# Altium schematic sheet 0176_S Rail power gener.SchDoc
size 848 x 558 mm
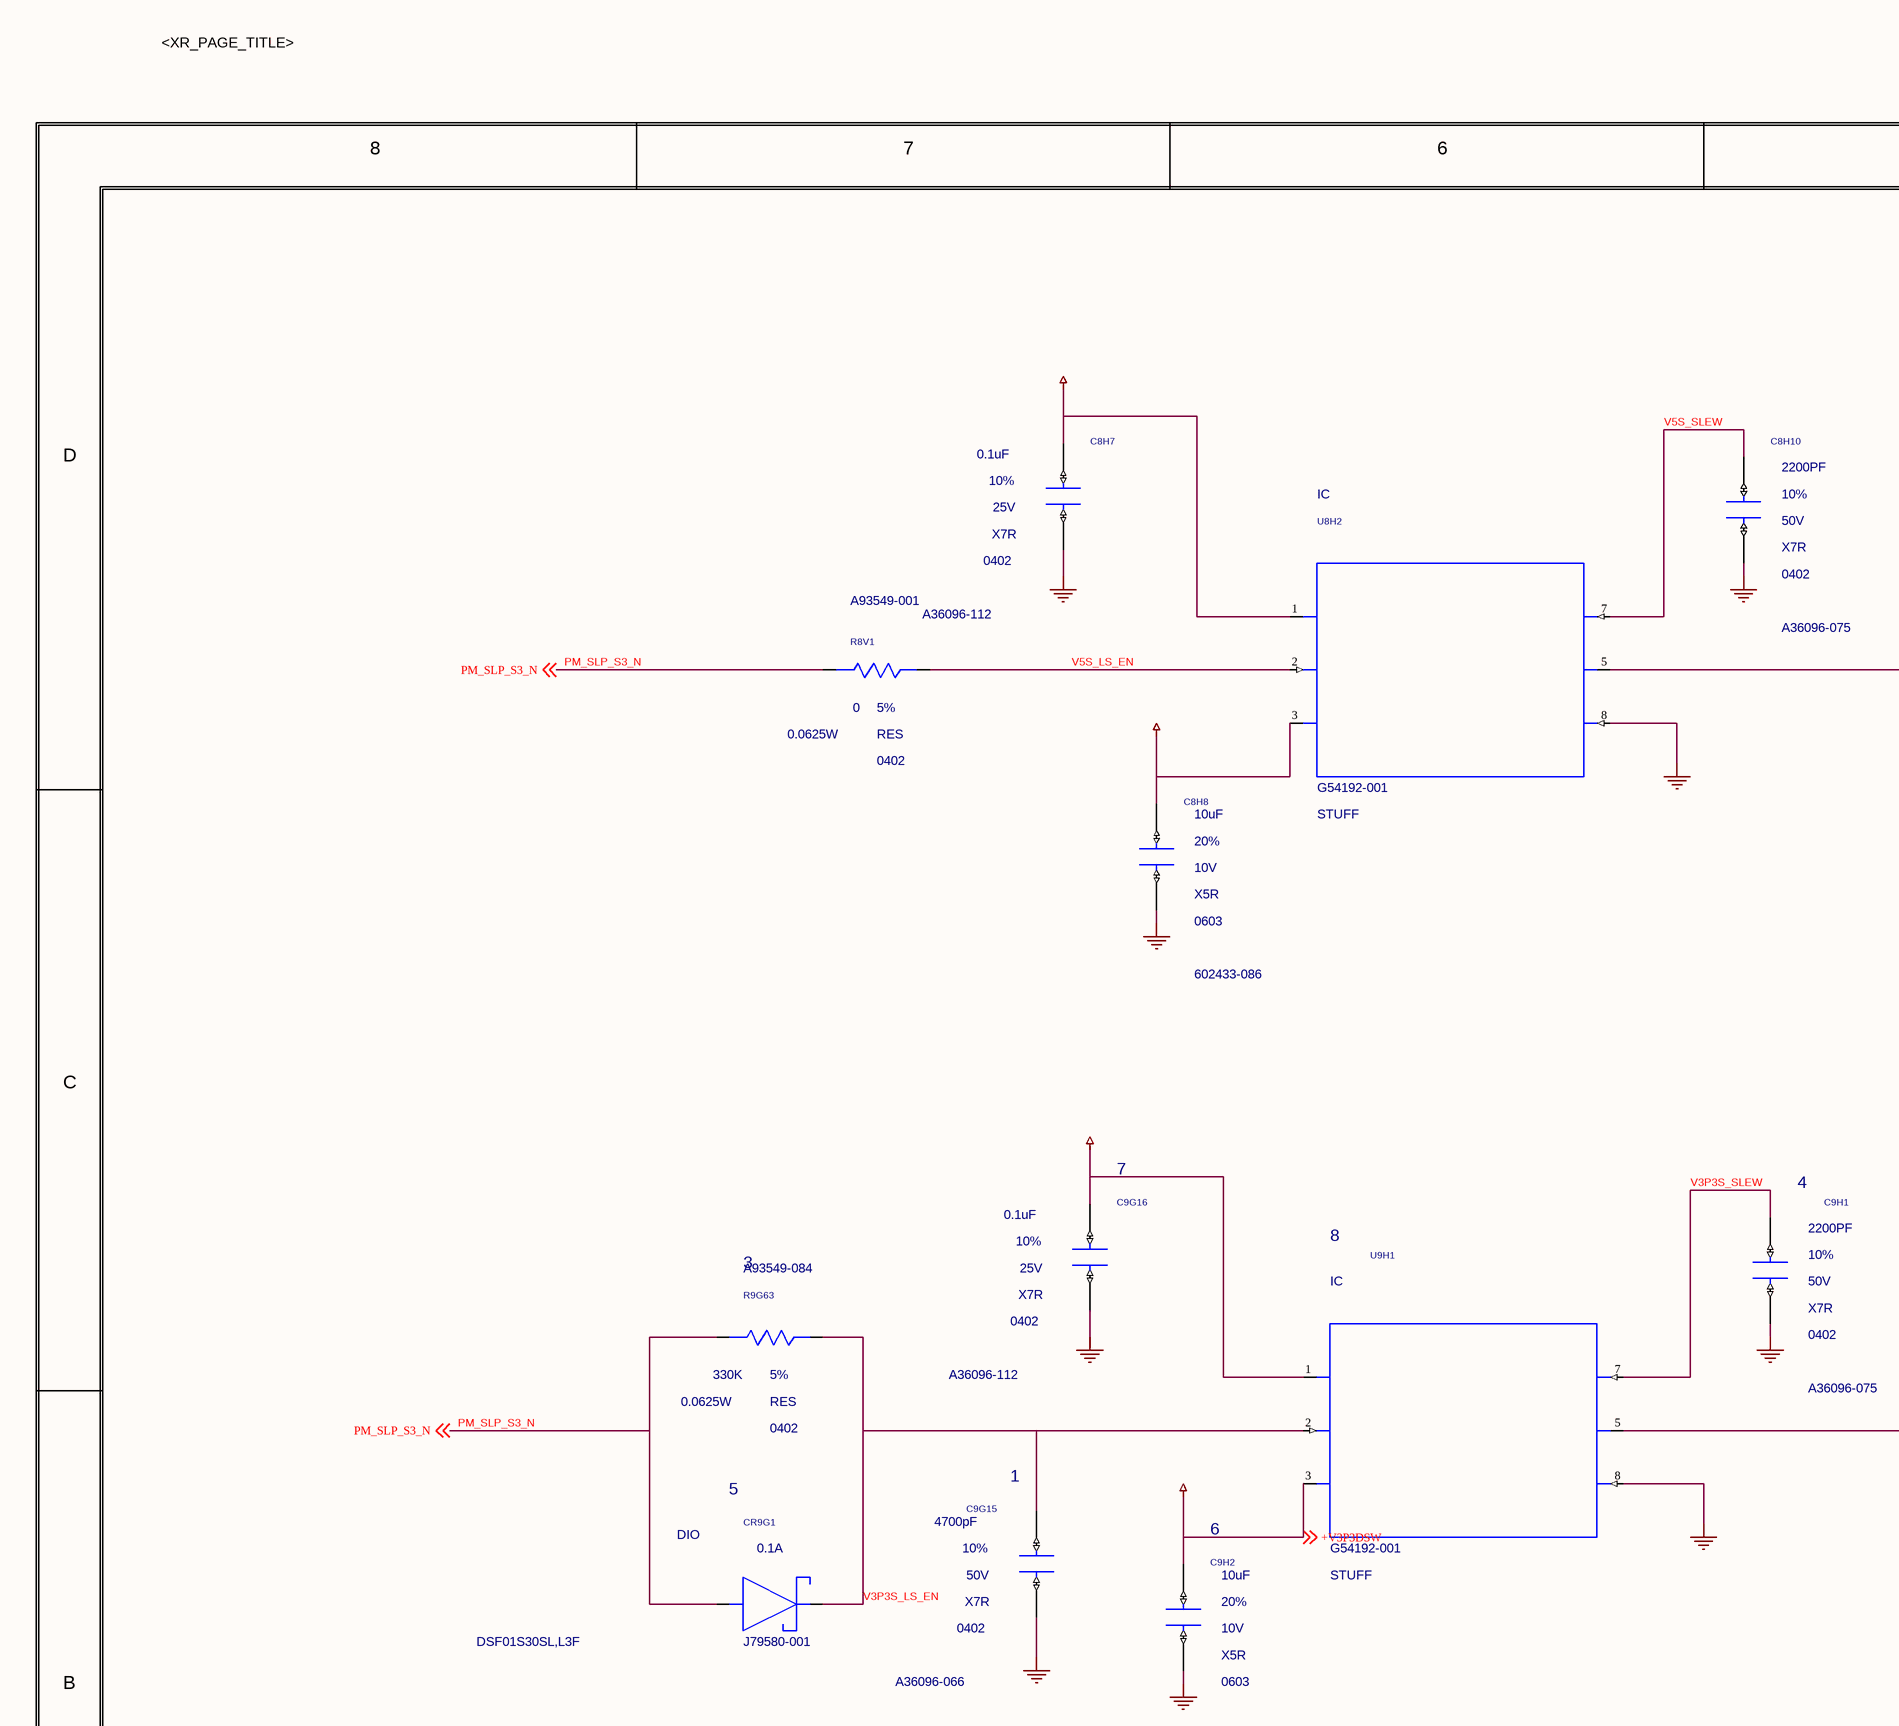
[diagram p0: 0176_S Rail power gener.SchDoc, top left]
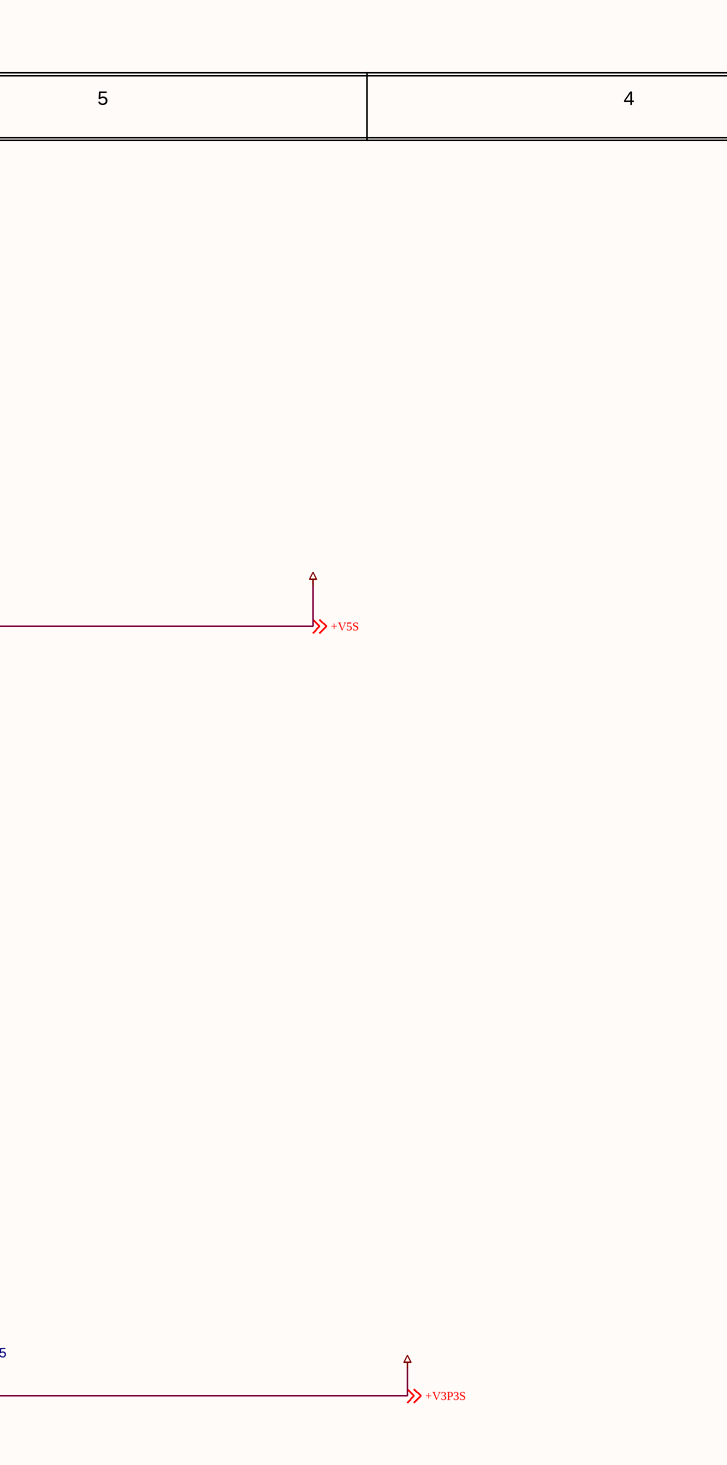
[diagram p1: 0176_S Rail power gener.SchDoc, top middle]
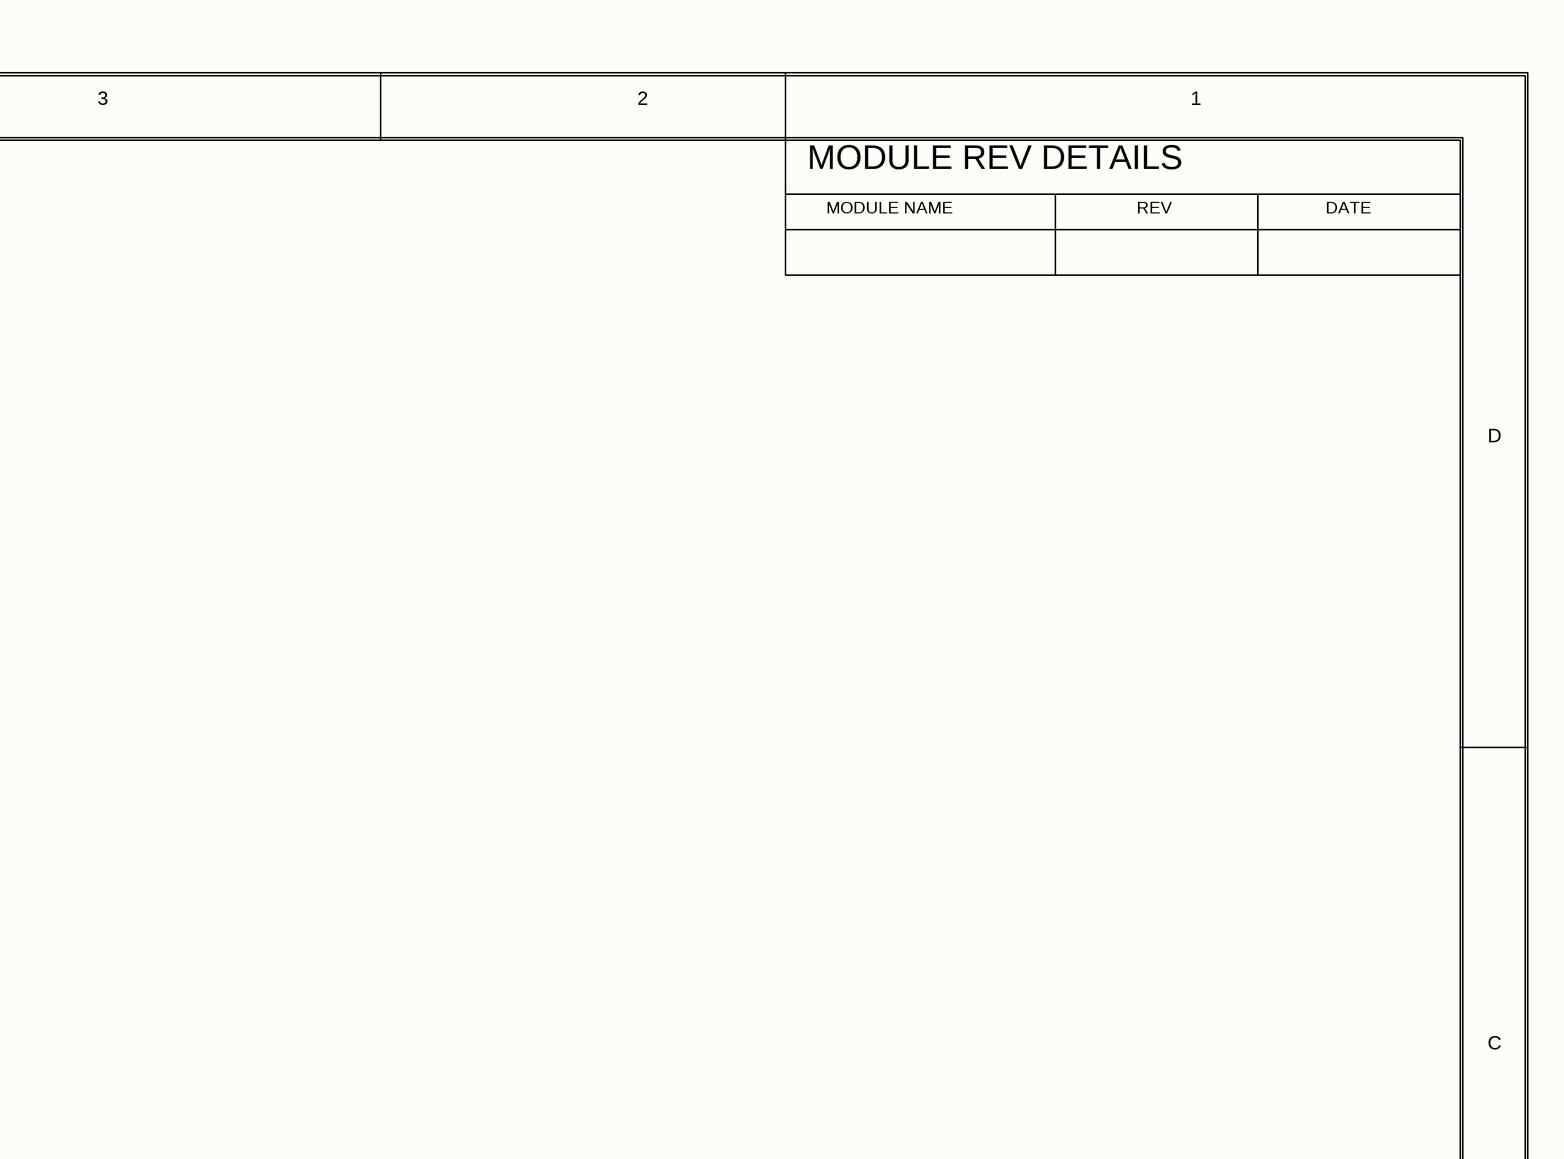
[diagram p2: 0176_S Rail power gener.SchDoc, top right]
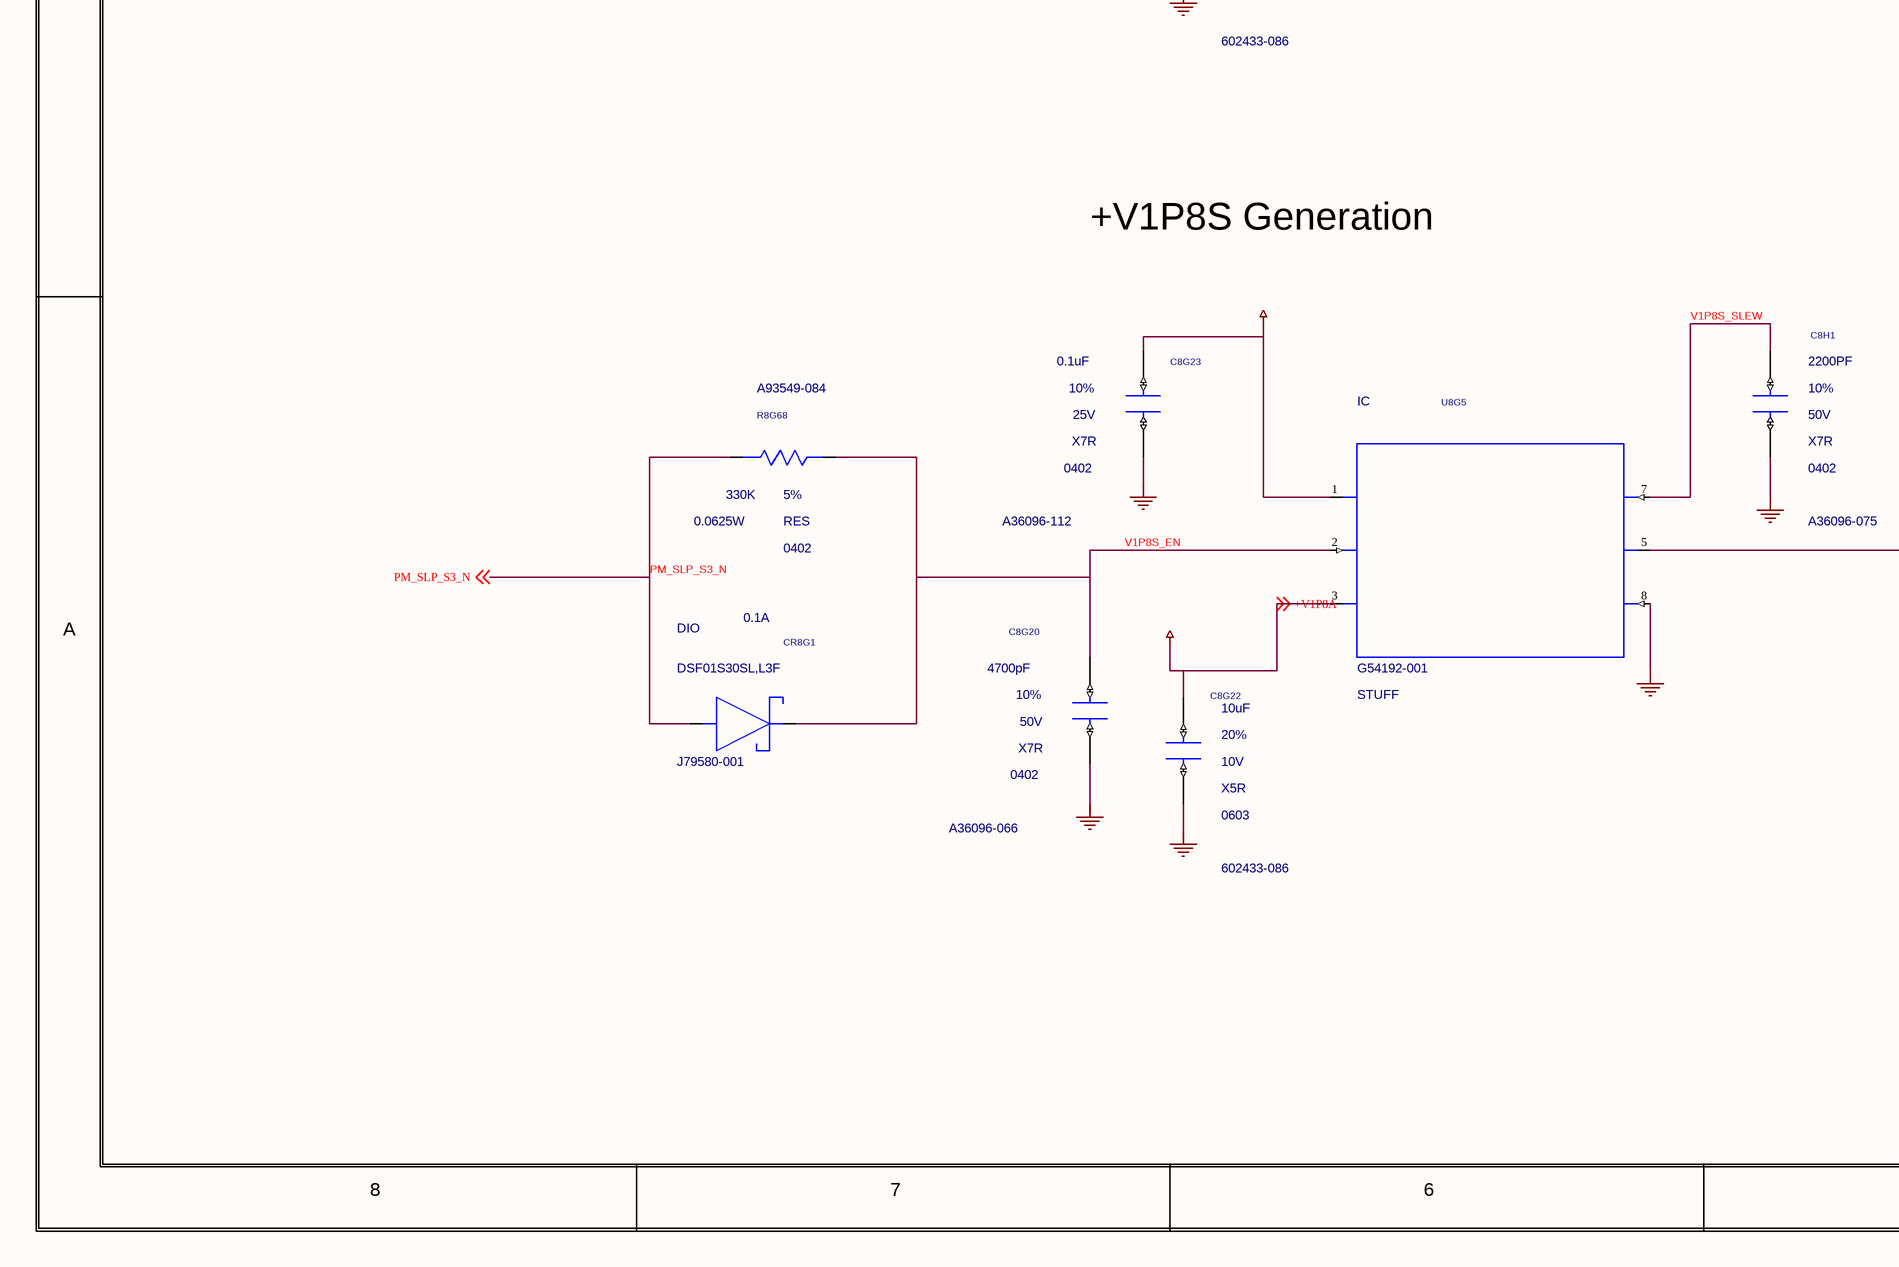
[diagram p3: 0176_S Rail power gener.SchDoc, bottom left]
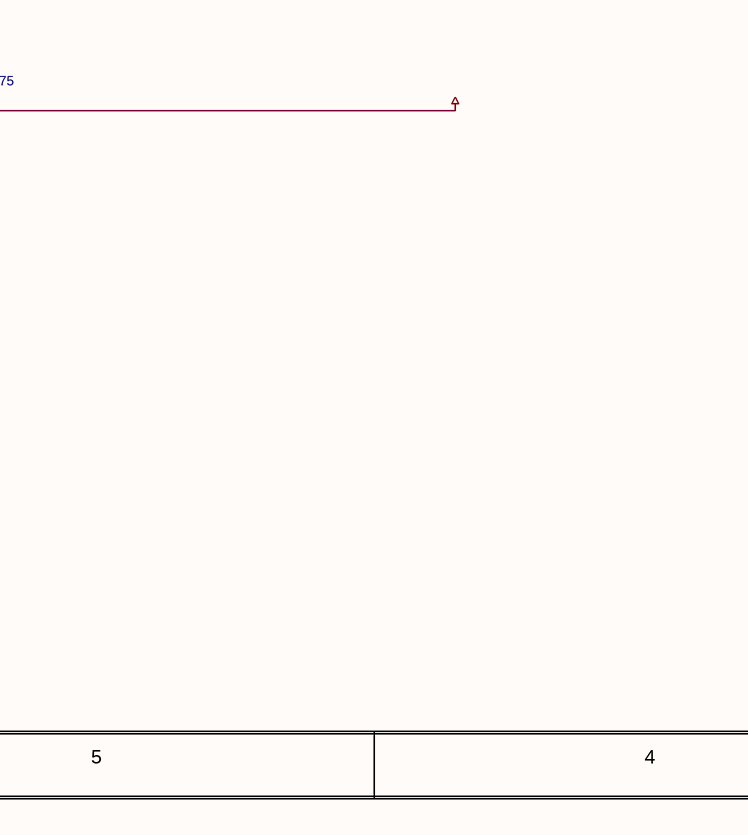
[diagram p4: 0176_S Rail power gener.SchDoc, bottom middle]
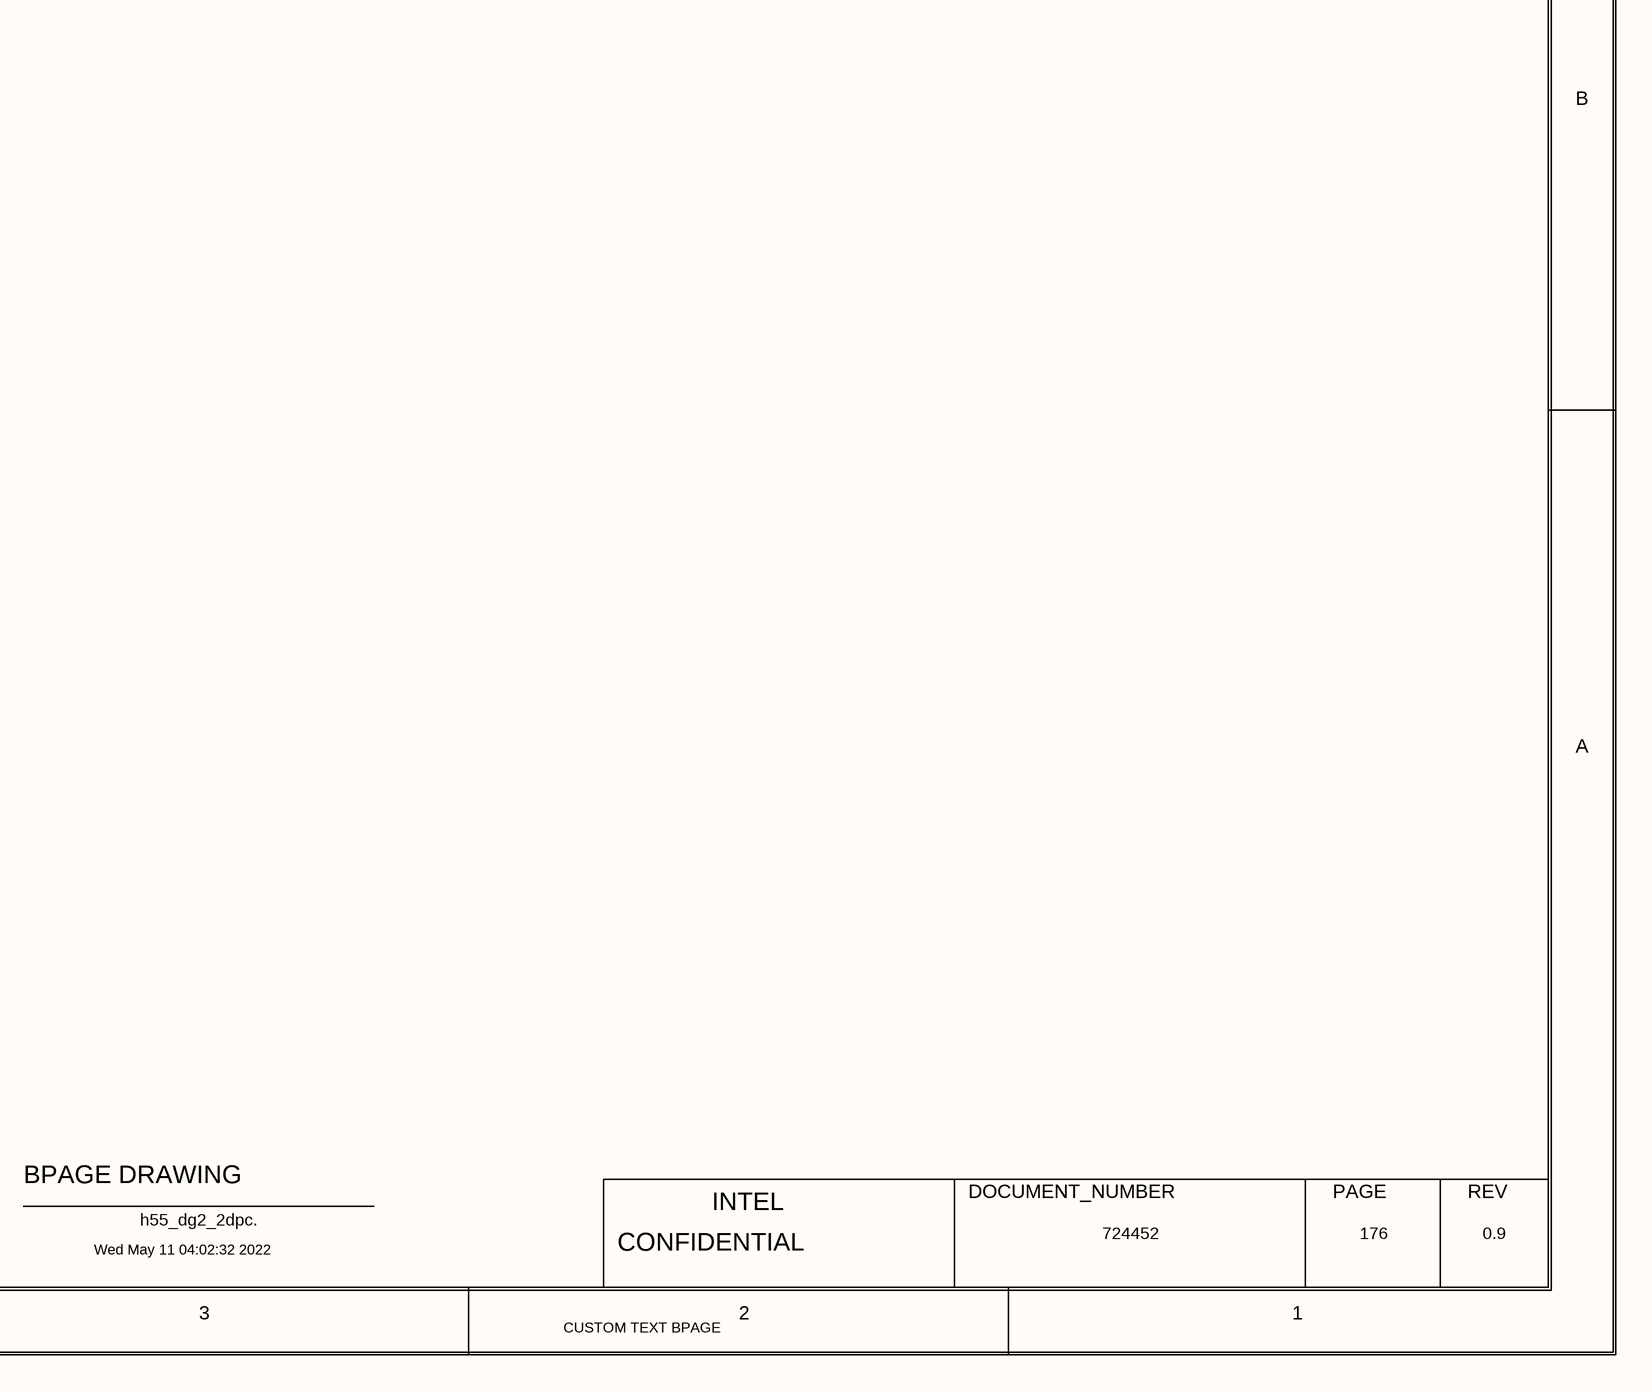
[diagram p5: 0176_S Rail power gener.SchDoc, bottom right]

## Parts
C8G20  4700pF  MATERIAL: X7R  PACK_TYPE: 0402  PART_NUMBER: A36096-066  TOLERANCE: 10%  VOLTAGE: 50V  [CTK2_SM0402_1050X550_MA]
C8G22  10uF  MATERIAL: X5R  PACK_TYPE: 0603  PART_NUMBER: 602433-086  TOLERANCE: 20%  VOLTAGE: 10V  [CTK2_SM0603_1700X900_MA]
C8G23  0.1uF  MATERIAL: X7R  PACK_TYPE: 0402  PART_NUMBER: A36096-112  TOLERANCE: 10%  VOLTAGE: 25V  [CTK2_SM0402_1050X550_MA]
C8H1  2200PF  MATERIAL: X7R  PACK_TYPE: 0402  PART_NUMBER: A36096-075  TOLERANCE: 10%  VOLTAGE: 50V  [CTK2_SM0402_1100X600_MA]
C8H7  0.1uF  MATERIAL: X7R  PACK_TYPE: 0402  PART_NUMBER: A36096-112  TOLERANCE: 10%  VOLTAGE: 25V  [CTK2_SM0402_1050X550_MA]
C8H8  10uF  MATERIAL: X5R  PACK_TYPE: 0603  PART_NUMBER: 602433-086  TOLERANCE: 20%  VOLTAGE: 10V  [CTK2_SM0603_1700X900_MA]
C8H10  2200PF  MATERIAL: X7R  PACK_TYPE: 0402  PART_NUMBER: A36096-075  TOLERANCE: 10%  VOLTAGE: 50V  [CTK2_SM0402_1100X600_MA]
C9G15  4700pF  MATERIAL: X7R  PACK_TYPE: 0402  PART_NUMBER: A36096-066  TOLERANCE: 10%  VOLTAGE: 50V  REUSE_ID: 1  [CTK2_SM0402_1050X550_MA]
C9G16  0.1uF  MATERIAL: X7R  PACK_TYPE: 0402  PART_NUMBER: A36096-112  TOLERANCE: 10%  VOLTAGE: 25V  REUSE_ID: 7  [CTK2_SM0402_1050X550_MA]
C9H1  2200PF  MATERIAL: X7R  PACK_TYPE: 0402  PART_NUMBER: A36096-075  TOLERANCE: 10%  VOLTAGE: 50V  REUSE_ID: 4  [CTK2_SM0402_1100X600_MA]
C9H2  10uF  MATERIAL: X5R  PACK_TYPE: 0603  PART_NUMBER: 602433-086  TOLERANCE: 20%  VOLTAGE: 10V  REUSE_ID: 6  [CTK2_SM0603_1700X900_MA]
CR8G1  DSF01S30SL,L3F  CURRENT: 0.1A  MATERIAL: DIO  PART_NUMBER: J79580-001  [CTK2_SCR0201_650X350_MA]
CR9G1  DSF01S30SL,L3F  CURRENT: 0.1A  MATERIAL: DIO  PART_NUMBER: J79580-001  REUSE_ID: 5  [CTK2_SCR0201_650X350_MA]
R8G68  330K  MATERIAL: RES  PACK_TYPE: 0402  PART_NUMBER: A93549-084  TOLERANCE: 5%  WATTAGE: 0.0625W  [CTK0_SM0402_1100X550_MA]
R8V1  0  MATERIAL: RES  PACK_TYPE: 0402  PART_NUMBER: A93549-001  TOLERANCE: 5%  WATTAGE: 0.0625W  [CTK0_SM0402_1100X550_MA]
R9G63  330K  MATERIAL: RES  PACK_TYPE: 0402  PART_NUMBER: A93549-084  TOLERANCE: 5%  WATTAGE: 0.0625W  REUSE_ID: 3  [CTK0_SM0402_1100X550_MA]
U8G5  BOM_USE: STUFF  MATERIAL: IC  PART_NUMBER: G54192-001  [TK2_LCC8_1550X2050_500_MA]  (hidden comment: SLG7NT402V_2)
U8H2  BOM_USE: STUFF  MATERIAL: IC  PART_NUMBER: G54192-001  [TK2_LCC8_1550X2050_500_MA]  (hidden comment: SLG7NT402V_2)
U9H1  BOM_USE: STUFF  MATERIAL: IC  PART_NUMBER: G54192-001  REUSE_ID: 8  [TK2_LCC8_1550X2050_500_MA]  (hidden comment: SLG7NT402V_2)

## Nets
+V1P8A: C8G22.1(A) U8G5.3(D) ; off-sheet +V1P8A
+V1P8S: U8G5.5(S)
+V3P3DSW: C9G16.1(A) C9H2.1(A) U9H1.1(VDD) U9H1.3(D) ; off-sheet +V3P3DSW
+V3P3S: U9H1.5(S) ; off-sheet +V3P3S
+V5A_L: C8G23.1(A) C8H7.1(A) C8H8.1(A) U8G5.1(VDD) U8H2.1(VDD) U8H2.3(D)
+V5S: U8H2.5(S) ; off-sheet +V5S
GND: C8G20.2(B) C8G22.2(B) C8G23.2(B) C8H1.2(B) C8H7.2(B) C8H8.2(B) C8H10.2(B) C9G15.2(B) C9G16.2(B) C9H1.2(B) C9H2.2(B) U8G5.8(GND) U8H2.8(GND) U9H1.8(GND)
PM_SLP_S3_N: CR8G1.A(ANODE) CR9G1.A(ANODE) R8G68.1(A) R8V1.1(A) R9G63.1(A) ; off-sheet PM_SLP_S3_N
V1P8S_EN: C8G20.1(A) CR8G1.C(CATHODE) R8G68.2(B) U8G5.2(ON)
V1P8S_SLEW: C8H1.1(A) U8G5.7(CAP)
V3P3S_LS_EN: C9G15.1(A) CR9G1.C(CATHODE) R9G63.2(B) U9H1.2(ON)
V3P3S_SLEW: C9H1.1(A) U9H1.7(CAP)
V5S_LS_EN: R8V1.2(B) U8H2.2(ON)
V5S_SLEW: C8H10.1(A) U8H2.7(CAP)

## Notes on the sheet
- <XR_PAGE_TITLE>
- 8
- 7
- 6
- 5
- 4
- 3
- 2
- 1
- MODULE REV DETAILS
- MODULE NAME
- REV
- DATE
- D
- C
- B
- +V1P8S Generation
- A
- BPAGE DRAWING
- INTEL
- DOCUMENT_NUMBER
- PAGE
- Wed May 11 04:02:32 2022
- h55_dg2_2dpc.
- CONFIDENTIAL
- 724452
- 176
- 0.9
- CUSTOM TEXT BPAGE

## Library data of the parts
C8G20 = C_CAP: CDS_PHYS_PART_NAME: C_CAP_0402-A36096-066,X7R,4700PF,50V,10%,TK2,GENERIC; CDS_LMAN_SYM_OUTLINE: -50,50,50,-50; FP_TECH: TK2; IP: GENERIC; ROOM: NONE; OriginalSymbolOrigin: (-50,25); XY: (-15200,-1575); VER: 1; ROT: 2; PHYS_PAGE: 176; LOCATION: C8G20; DRAWING: @RVP1_ADL_SB_ADP_S_DDR5_SODIMM_2DPC_LIB.H55_DG2_2DPC(SCH_1):PAGE545; CDS_LIB: c_discrete; VARIANT: ?; PCB Footprint: CTK2_SM0402_1050X550_MA; SEC_TYPE: 0402; CHIPS_PART_NAME: C_CAP; CDS_PART_NAME: C_CAP_0402-A36096-066,X7R,4700PF,50V,10%,TK2,GENERIC; CDS_LOCATION: C8G20; ASI_MODEL: A36096-066
C8G22 = C_CAP: CDS_PHYS_PART_NAME: C_CAP_0603-602433-086,X5R,10UF,10V,20%,TK2,GENERIC; CDS_LMAN_SYM_OUTLINE: -50,50,50,-50; FP_TECH: TK2; IP: GENERIC; ROOM: NONE; OriginalSymbolOrigin: (-50,25); XY: (-15025,-1650); VER: 1; ROT: 0; PHYS_PAGE: 176; LOCATION: C8G22; DRAWING: @RVP1_ADL_SB_ADP_S_DDR5_SODIMM_2DPC_LIB.H55_DG2_2DPC(SCH_1):PAGE545; CDS_LIB: c_discrete; VARIANT: ?; PCB Footprint: CTK2_SM0603_1700X900_MA; SEC_TYPE: 0603; CHIPS_PART_NAME: C_CAP; CDS_PART_NAME: C_CAP_0603-602433-086,X5R,10UF,10V,20%,TK2,GENERIC; CDS_LOCATION: C8G22; ASI_MODEL: 602433-086
C8G23 = C_CAP: CDS_PHYS_PART_NAME: CAP_402-.1UF,10%,10V,X5R,A36096-084"; CDS_PART_NAME: C_CAP_0402-A36096-112,X7R,0.1UF,25V,10%,TK2,GENERIC; CDS_LMAN_SYM_OUTLINE: -50,50,50,-50; FP_TECH: TK2; IP: GENERIC; ROOM: NONE; OriginalSymbolOrigin: (-50,25); XY: (-15100,-1000); VER: 1; ROT: 2; PHYS_PAGE: 176; LOCATION: C8G23; DRAWING: @RVP1_ADL_SB_ADP_S_DDR5_SODIMM_2DPC_LIB.H55_DG2_2DPC(SCH_1):PAGE545; CDS_LIB: c_discrete; VARIANT: ?; PCB Footprint: CTK2_SM0402_1050X550_MA; SEC_TYPE: 0402; CHIPS_PART_NAME: C_CAP; CDS_LOCATION: C8G23; ASI_MODEL: A36096-112
C8H1 = C_CAP: CDS_PHYS_PART_NAME: CAP_402-2200PF,10%,50V"; CDS_PART_NAME: C_CAP_0402-A36096-075,X7R,2200PF,50V,10%,TK2,GENERIC; CDS_LMAN_SYM_OUTLINE: -50,50,50,-50; FP_TECH: TK2; IP: GENERIC; ROOM: NONE; OriginalSymbolOrigin: (-50,25); XY: (-13925,-1000); VER: 1; ROT: 0; PHYS_PAGE: 176; LOCATION: C8H1; DRAWING: @RVP1_ADL_SB_ADP_S_DDR5_SODIMM_2DPC_LIB.H55_DG2_2DPC(SCH_1):PAGE545; CDS_LIB: c_discrete; VARIANT: ?; PCB Footprint: CTK2_SM0402_1100X600_MA; SEC_TYPE: 0402; CHIPS_PART_NAME: C_CAP; CDS_LOCATION: C8H1; ASI_MODEL: A36096-075
C8H7 = C_CAP: CDS_PHYS_PART_NAME: CAP_402-.1UF,10%,10V,X5R,A36096-084"; CDS_PART_NAME: C_CAP_0402-A36096-112,X7R,0.1UF,25V,10%,TK2,GENERIC; CDS_LMAN_SYM_OUTLINE: -50,50,50,-50; FP_TECH: TK2; IP: GENERIC; ROOM: NONE; OriginalSymbolOrigin: (-50,25); XY: (-15250,2000); VER: 1; ROT: 2; PHYS_PAGE: 176; LOCATION: C8H7; DRAWING: @RVP1_ADL_SB_ADP_S_DDR5_SODIMM_2DPC_LIB.H55_DG2_2DPC(SCH_1):PAGE545; CDS_LIB: c_discrete; VARIANT: ?; PCB Footprint: CTK2_SM0402_1050X550_MA; SEC_TYPE: 0402; CHIPS_PART_NAME: C_CAP; CDS_LOCATION: C8H7; ASI_MODEL: A36096-112
C8H8 = C_CAP: CDS_PHYS_PART_NAME: CAP_603-10UF,20%,6.3V,603"; CDS_PART_NAME: C_CAP_0603-602433-086,X5R,10UF,10V,20%,TK2,GENERIC; CDS_LMAN_SYM_OUTLINE: -50,50,50,-50; FP_TECH: TK2; IP: GENERIC; ROOM: NONE; OriginalSymbolOrigin: (-50,25); XY: (-15075,1325); VER: 1; ROT: 0; PHYS_PAGE: 176; LOCATION: C8H8; DRAWING: @RVP1_ADL_SB_ADP_S_DDR5_SODIMM_2DPC_LIB.H55_DG2_2DPC(SCH_1):PAGE545; CDS_LIB: c_discrete; VARIANT: ?; PCB Footprint: CTK2_SM0603_1700X900_MA; SEC_TYPE: 0603; CHIPS_PART_NAME: C_CAP; CDS_LOCATION: C8H8; ASI_MODEL: 602433-086
C8H10 = C_CAP: CDS_PHYS_PART_NAME: CAP_402-2200PF,10%,50V"; CDS_PART_NAME: C_CAP_0402-A36096-075,X7R,2200PF,50V,10%,TK2,GENERIC; CDS_LMAN_SYM_OUTLINE: -50,50,50,-50; FP_TECH: TK2; IP: GENERIC; ROOM: NONE; OriginalSymbolOrigin: (-50,25); XY: (-13975,1975); VER: 1; ROT: 0; PHYS_PAGE: 176; LOCATION: C8H10; DRAWING: @RVP1_ADL_SB_ADP_S_DDR5_SODIMM_2DPC_LIB.H55_DG2_2DPC(SCH_1):PAGE545; CDS_LIB: c_discrete; VARIANT: ?; PCB Footprint: CTK2_SM0402_1100X600_MA; SEC_TYPE: 0402; CHIPS_PART_NAME: C_CAP; CDS_LOCATION: C8H10; ASI_MODEL: A36096-075
C9G15 = C_CAP: CDS_PHYS_PART_NAME: C_CAP_0402-A36096-066,X7R,4700PF,50V,10%,TK2,GENERIC; CDS_LMAN_SYM_OUTLINE: -50,50,50,-50; FP_TECH: TK2; IP: GENERIC; ROOM: NONE; OriginalSymbolOrigin: (-50,25); XY: (-15300,0); ROT: 2; PHYS_PAGE: 176; LOCATION: C9G15; DRAWING: @RVP1_ADL_SB_ADP_S_DDR5_SODIMM_2DPC_LIB.H55_DG2_2DPC(SCH_1):PAGE545; CDS_LIB: c_discrete; VARIANT: ?; PCB Footprint: CTK2_SM0402_1050X550_MA; VER: 1; SEC_TYPE: 0402; CHIPS_PART_NAME: C_CAP; CDS_PART_NAME: C_CAP_0402-A36096-066,X7R,4700PF,50V,10%,TK2,GENERIC; CDS_LOCATION: C9G15; ASI_MODEL: A36096-066
C9G16 = C_CAP: CDS_PHYS_PART_NAME: CAP_402-.1UF,10%,10V,X5R,A36096-084"; CDS_PART_NAME: C_CAP_0402-A36096-112,X7R,0.1UF,25V,10%,TK2,GENERIC; CDS_LMAN_SYM_OUTLINE: -50,50,50,-50; FP_TECH: TK2; IP: GENERIC; ROOM: NONE; OriginalSymbolOrigin: (-50,25); XY: (-15200,575); VER: 1; ROT: 2; PHYS_PAGE: 176; LOCATION: C9G16; DRAWING: @RVP1_ADL_SB_ADP_S_DDR5_SODIMM_2DPC_LIB.H55_DG2_2DPC(SCH_1):PAGE545; CDS_LIB: c_discrete; VARIANT: ?; PCB Footprint: CTK2_SM0402_1050X550_MA; SEC_TYPE: 0402; CHIPS_PART_NAME: C_CAP; CDS_LOCATION: C9G16; ASI_MODEL: A36096-112
C9H1 = C_CAP: CDS_PHYS_PART_NAME: CAP_402-2200PF,10%,50V"; CDS_PART_NAME: C_CAP_0402-A36096-075,X7R,2200PF,50V,10%,TK2,GENERIC; CDS_LMAN_SYM_OUTLINE: -50,50,50,-50; FP_TECH: TK2; IP: GENERIC; ROOM: NONE; OriginalSymbolOrigin: (-50,25); XY: (-13925,550); VER: 1; ROT: 0; PHYS_PAGE: 176; LOCATION: C9H1; DRAWING: @RVP1_ADL_SB_ADP_S_DDR5_SODIMM_2DPC_LIB.H55_DG2_2DPC(SCH_1):PAGE545; CDS_LIB: c_discrete; VARIANT: ?; PCB Footprint: CTK2_SM0402_1100X600_MA; SEC_TYPE: 0402; CHIPS_PART_NAME: C_CAP; CDS_LOCATION: C9H1; ASI_MODEL: A36096-075
C9H2 = C_CAP: CDS_PHYS_PART_NAME: CAP_603-10UF,20%,6.3V,603"; CDS_PART_NAME: C_CAP_0603-602433-086,X5R,10UF,10V,20%,TK2,GENERIC; CDS_LMAN_SYM_OUTLINE: -50,50,50,-50; FP_TECH: TK2; IP: GENERIC; ROOM: NONE; OriginalSymbolOrigin: (-50,25); XY: (-15025,-100); VER: 1; ROT: 0; PHYS_PAGE: 176; LOCATION: C9H2; DRAWING: @RVP1_ADL_SB_ADP_S_DDR5_SODIMM_2DPC_LIB.H55_DG2_2DPC(SCH_1):PAGE545; CDS_LIB: c_discrete; VARIANT: ?; PCB Footprint: CTK2_SM0603_1700X900_MA; SEC_TYPE: 0603; CHIPS_PART_NAME: C_CAP; CDS_LOCATION: C9H2; ASI_MODEL: 602433-086
CR8G1 = C_DIODE_SCHOTTKY: CDS_PHYS_PART_NAME: C_DIODE_SCHOTTKY_SM-J79580-001,DIO,DSF01S30SL,L3F,0.1A,TK2,GENEA; CDS_LMAN_SYM_OUTLINE: -50,100,50,-100; FP_TECH: TK2; IP: GENERIC; PACK_TYPE: SM; ROOM: NONE; OriginalSymbolOrigin: (-75,50); XY: (-15850,-1600); VER: 1; ROT: 0; PHYS_PAGE: 176; LOCATION: CR8G1; DRAWING: @RVP1_ADL_SB_ADP_S_DDR5_SODIMM_2DPC_LIB.H55_DG2_2DPC(SCH_1):PAGE545; CDS_LIB: local; VARIANT: ?; PCB Footprint: CTK2_SCR0201_650X350_MA; SEC_TYPE: SM; CHIPS_PART_NAME: C_DIODE_SCHOTTKY; CDS_PART_NAME: C_DIODE_SCHOTTKY_SM-J79580-001,DIO,DSF01S30SL,L3F,0.1A,TK2,GENEA; CDS_LOCATION: CR8G1
CR9G1 = C_DIODE_SCHOTTKY: CDS_PHYS_PART_NAME: C_DIODE_SCHOTTKY_SM-J79580-001,DIO,DSF01S30SL,L3F,0.1A,TK2,GENEA; CDS_LMAN_SYM_OUTLINE: -50,100,50,-100; FP_TECH: TK2; IP: GENERIC; PACK_TYPE: SM; ROOM: NONE; OriginalSymbolOrigin: (-75,50); XY: (-15800,-75); VER: 1; ROT: 0; PHYS_PAGE: 176; LOCATION: CR9G1; DRAWING: @RVP1_ADL_SB_ADP_S_DDR5_SODIMM_2DPC_LIB.H55_DG2_2DPC(SCH_1):PAGE545; CDS_LIB: local; VARIANT: ?; PCB Footprint: CTK2_SCR0201_650X350_MA; SEC_TYPE: SM; CHIPS_PART_NAME: C_DIODE_SCHOTTKY; CDS_PART_NAME: C_DIODE_SCHOTTKY_SM-J79580-001,DIO,DSF01S30SL,L3F,0.1A,TK2,GENEA; CDS_LOCATION: CR9G1
R8G68 = C_RES#1: CHIPS_PART_NAME: C_RES; CDS_PHYS_PART_NAME: C_RES_0402-A93549-084,RES,330K,5%,0.0625W,TK0,GENERIC; CDS_LMAN_SYM_OUTLINE: -50,50,50,-50; FP_TECH: TK0; IP: GENERIC; ROOM: NONE; OriginalSymbolOrigin: (-75,25); XY: (-15775,-1100); VER: 1; ROT: 0; PHYS_PAGE: 176; LOCATION: R8G68; DRAWING: @RVP1_ADL_SB_ADP_S_DDR5_SODIMM_2DPC_LIB.H55_DG2_2DPC(SCH_1):PAGE545; CDS_LIB: c_discrete; VARIANT: ?; PCB Footprint: CTK0_SM0402_1100X550_MA; SEC_TYPE: 0402; CDS_PART_NAME: C_RES_0402-A93549-084,RES,330K,5%,0.0625W,TK0,GENERIC; CDS_LOCATION: R8G68; ASI_MODEL: A93549-084
R8V1 = C_RES#1: CHIPS_PART_NAME: C_RES; CDS_PHYS_PART_NAME: C_RES_0402-A93549-001,RES,0,5%,0.0625W,TK0,GENERIC; CDS_LMAN_SYM_OUTLINE: -50,50,50,-50; FP_TECH: TK0; IP: GENERIC; ROOM: NONE; OriginalSymbolOrigin: (-75,25); XY: (-15600,1675); VER: 1; PHYS_PAGE: 176; LOCATION: R8V1; DRAWING: @RVP1_ADL_SB_ADP_S_DDR5_SODIMM_2DPC_LIB.H55_DG2_2DPC(SCH_1):PAGE545; CDS_LIB: c_discrete; VARIANT: ?; PCB Footprint: CTK0_SM0402_1100X550_MA; SEC_TYPE: 0402; ROT: 0; CDS_PART_NAME: C_RES_0402-A93549-001,RES,0,5%,0.0625W,TK0,GENERIC; CDS_LOCATION: R8V1; ASI_MODEL: A93549-001
R9G63 = C_RES#1: CHIPS_PART_NAME: C_RES; CDS_PHYS_PART_NAME: C_RES_0402-A93549-084,RES,330K,5%,0.0625W,TK0,GENERIC; CDS_LMAN_SYM_OUTLINE: -50,50,50,-50; FP_TECH: TK0; IP: GENERIC; ROOM: NONE; OriginalSymbolOrigin: (-75,25); XY: (-15800,425); VER: 1; ROT: 0; PHYS_PAGE: 176; LOCATION: R9G63; DRAWING: @RVP1_ADL_SB_ADP_S_DDR5_SODIMM_2DPC_LIB.H55_DG2_2DPC(SCH_1):PAGE545; CDS_LIB: c_discrete; VARIANT: ?; PCB Footprint: CTK0_SM0402_1100X550_MA; SEC_TYPE: 0402; CDS_PART_NAME: C_RES_0402-A93549-084,RES,330K,5%,0.0625W,TK0,GENERIC; CDS_LOCATION: R9G63; ASI_MODEL: A93549-084
U8G5 = SLG7NT402V_2: CDS_PHYS_PART_NAME: SLG7NT402V_2_LCC-G54192-001,IC,SLG7NT402V,TK2,GENERIC; CDS_LMAN_SYM_OUTLINE: -250,200,250,-200; FP_TECH: TK2; IP: GENERIC; PACK_TYPE: LCC; ROOM: NONE; OriginalSymbolOrigin: (-275,200); XY: (-14450,-1275); VER: 1; ROT: 0; PHYS_PAGE: 176; LOCATION: U8G5; DRAWING: @RVP1_ADL_SB_ADP_S_DDR5_SODIMM_2DPC_LIB.H55_DG2_2DPC(SCH_1):PAGE545; CDS_LIB: local; VARIANT: ?; PCB Footprint: TK2_LCC8_1550X2050_500_MA; CHIPS_PART_NAME: SLG7NT402V_2; CDS_PART_NAME: SLG7NT402V_2_LCC-G54192-001,IC,SLG7NT402V,TK2,GENERIC; CDS_LOCATION: U8G5; ASI_MODEL: G54192-001
U8H2 = SLG7NT402V_2: CDS_PHYS_PART_NAME: SLG7NT402V_2_LCC-G54192-001,IC,SLG7NT402V,TK2,GENERIC; CDS_LMAN_SYM_OUTLINE: -250,200,250,-200; FP_TECH: TK2; IP: GENERIC; PACK_TYPE: LCC; ROOM: NONE; OriginalSymbolOrigin: (-275,200); XY: (-14525,1675); VER: 1; ROT: 0; PHYS_PAGE: 176; LOCATION: U8H2; DRAWING: @RVP1_ADL_SB_ADP_S_DDR5_SODIMM_2DPC_LIB.H55_DG2_2DPC(SCH_1):PAGE545; CDS_LIB: local; VARIANT: ?; PCB Footprint: TK2_LCC8_1550X2050_500_MA; SEC_TYPE: LCC; CHIPS_PART_NAME: SLG7NT402V_2; CDS_PART_NAME: SLG7NT402V_2_LCC-G54192-001,IC,SLG7NT402V,TK2,GENERIC; CDS_LOCATION: U8H2; ASI_MODEL: G54192-001
U9H1 = SLG7NT402V_2: CDS_PHYS_PART_NAME: SLG7NT402V_2_LCC-G54192-001,IC,SLG7NT402V,TK2,GENERIC; CDS_LMAN_SYM_OUTLINE: -250,200,250,-200; FP_TECH: TK2; IP: GENERIC; PACK_TYPE: LCC; ROOM: NONE; OriginalSymbolOrigin: (-275,200); XY: (-14500,250); VER: 1; ROT: 0; PHYS_PAGE: 176; LOCATION: U9H1; DRAWING: @RVP1_ADL_SB_ADP_S_DDR5_SODIMM_2DPC_LIB.H55_DG2_2DPC(SCH_1):PAGE545; CDS_LIB: local; VARIANT: ?; PCB Footprint: TK2_LCC8_1550X2050_500_MA; SEC_TYPE: LCC; CHIPS_PART_NAME: SLG7NT402V_2; CDS_PART_NAME: SLG7NT402V_2_LCC-G54192-001,IC,SLG7NT402V,TK2,GENERIC; CDS_LOCATION: U9H1; ASI_MODEL: G54192-001